# EAGLE design lp_proto (EAGLE 6.4)
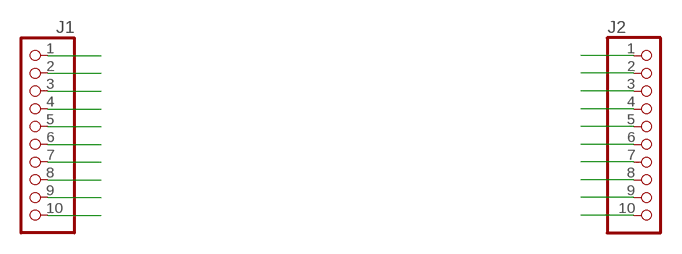
[diagram p0: schematic, sheet 1]

## Parts
J1  PH1X10OCT076  [PH1X10OCT76]
J2  PH1X10OCT076  [PH1X10OCT76]

## Nets
N$3: J2.5
N$21: J2.3
N$22: J2.6
N$23: J2.7
N$24: J2.8
N$25: J2.10
N$26: J2.9
N$99: J1.2
N$134: J1.10
N$136: J2.2
N$147: J1.3
N$262: J1.4
N$276: J1.5
N$346: J2.4
N$347: J1.9
N$348: J1.8
N$349: J1.7
N$350: J1.6
VCC: J1.1
VSS [Ground]: J2.1

## Library data of the parts
J1 J2 = MY_CONN:PH1X10

## Net classes
1 Ground: width 0.1 mm, drill 0.2 mm

## Board
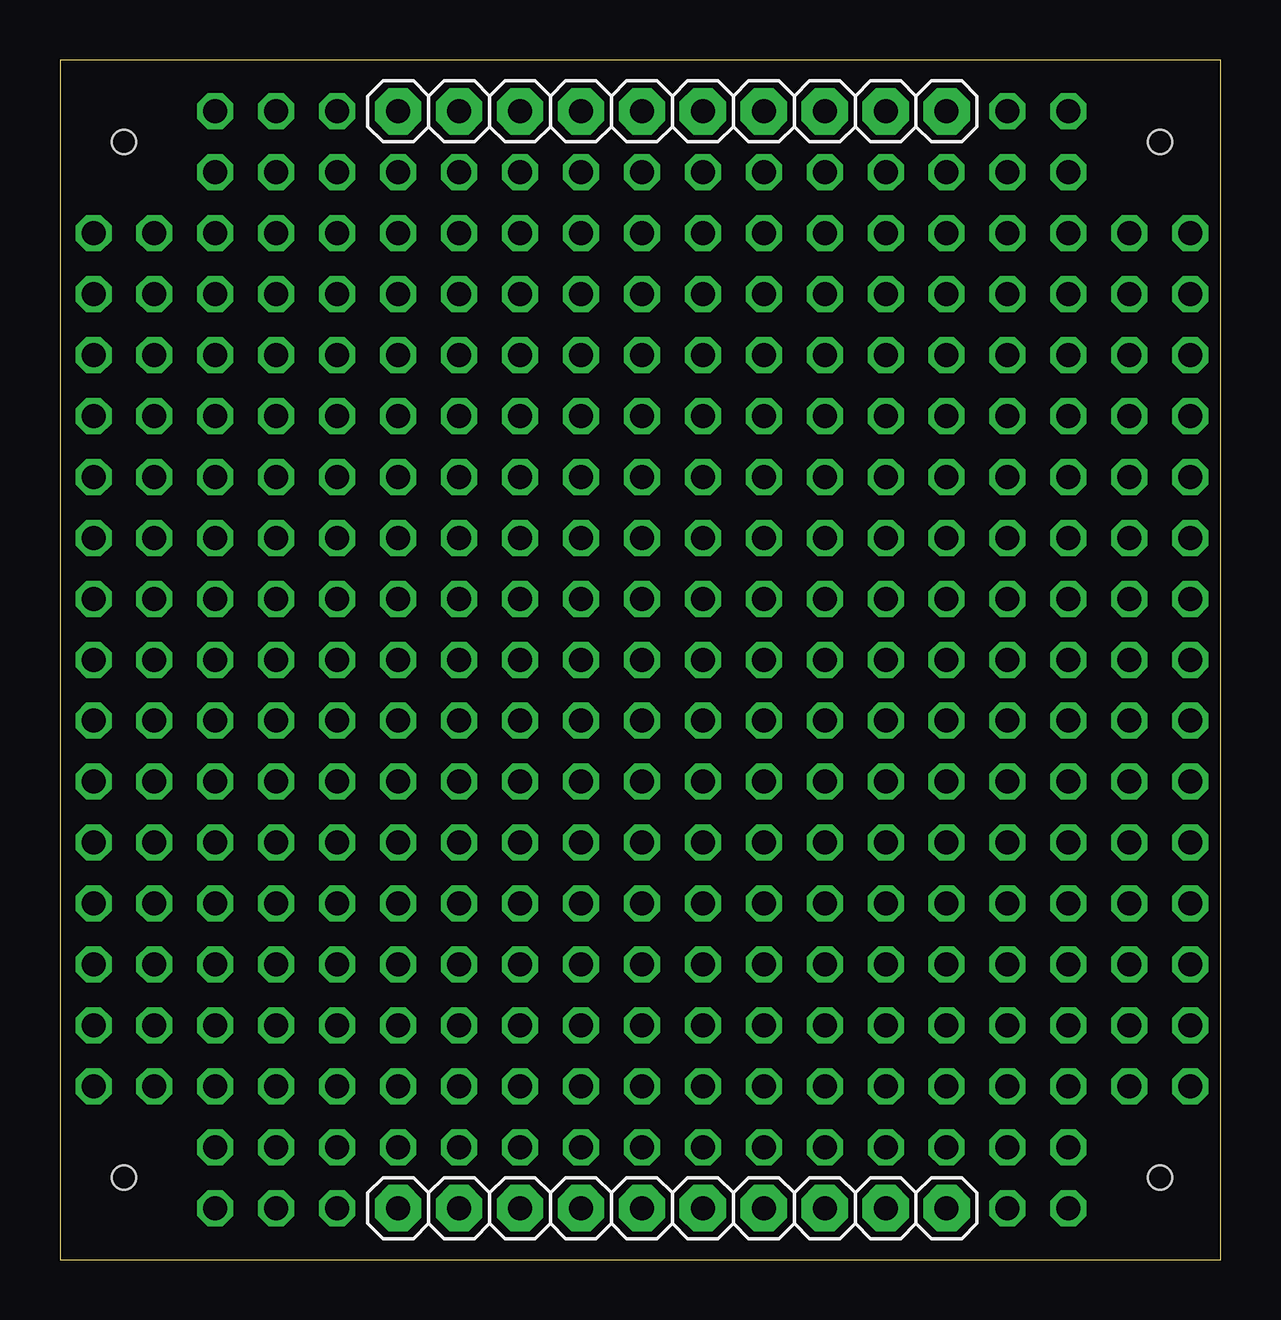
[diagram p1: board, top side]
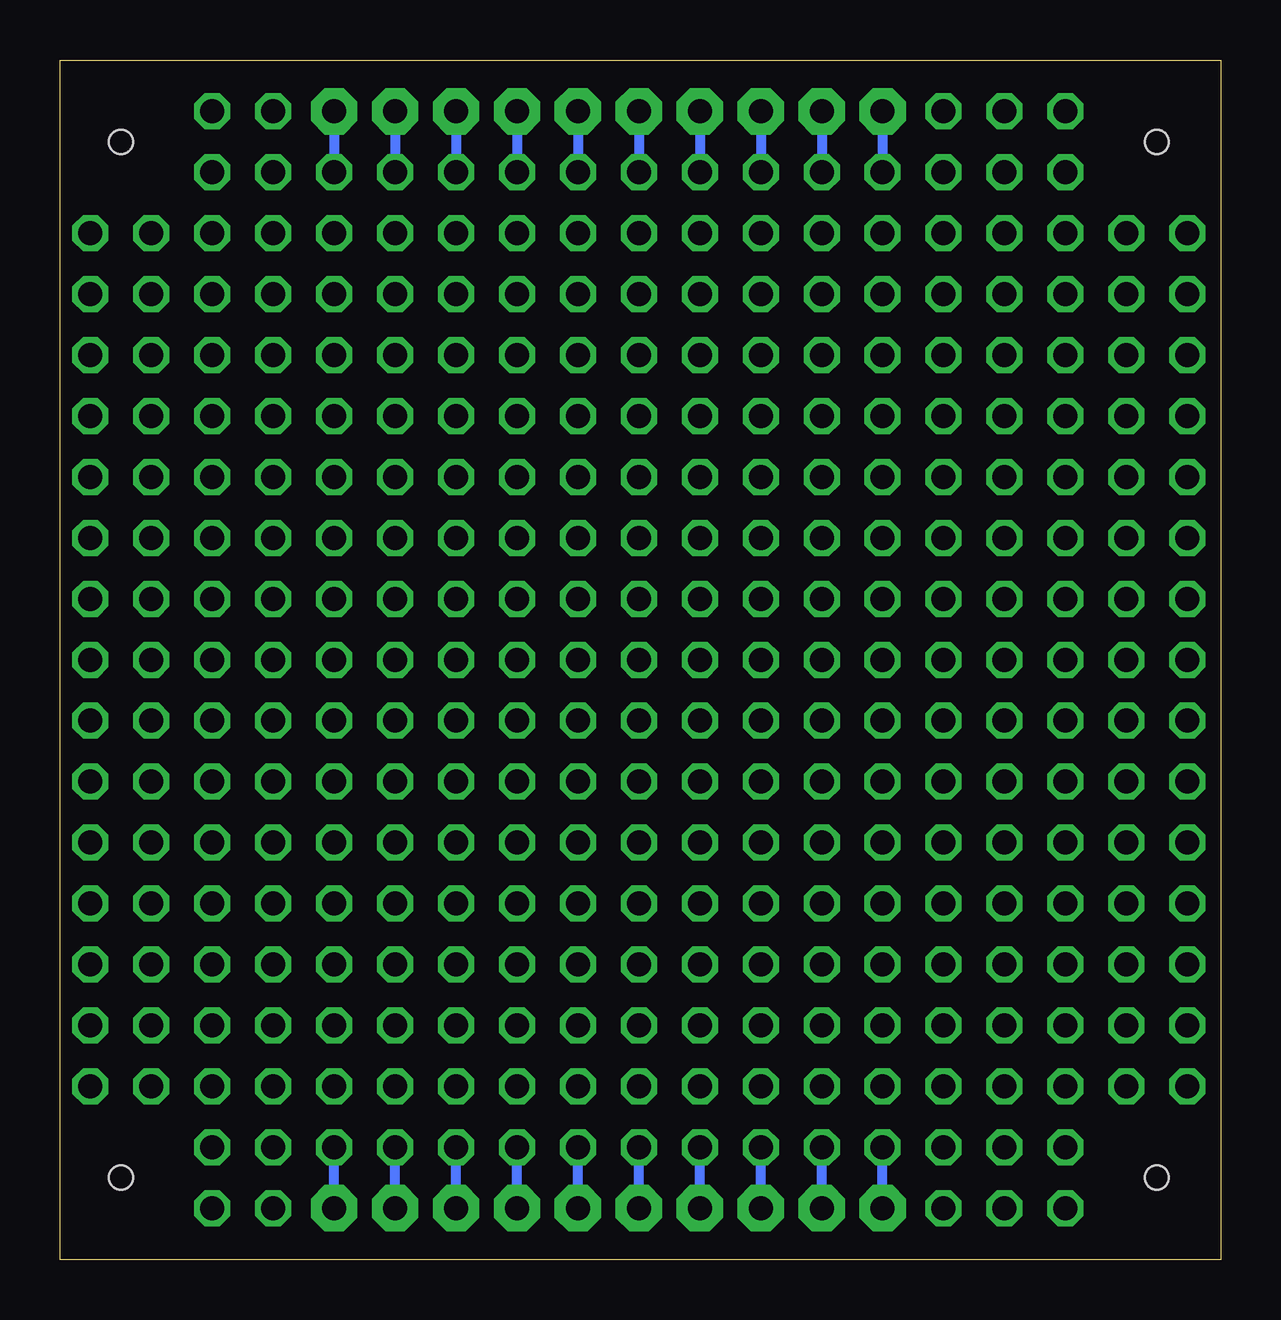
[diagram p2: board, bottom side, seen from below]

Size 48.39 x 50 mm. Coordinates in mm from the lower left corner, seen from the top.
Outline: 0,0 48.39,0 48.39,50 0,50 0,0
Copper layers (1*16): Top 0.035mm / dielectric 1.5mm / Bottom 0.035mm
Design rules "Fusion_eagle_rule_v1.1": minimum track width 6mil, minimum drill 12mil, track to track 6mil, track to pad 6mil, pad to pad 6mil, via to via 6mil, smd to smd 0mil, copper to edge 10mil, drill to drill 10mil, minimum pad ring 10mil, minimum via ring 6mil, stop-mask expansion 2mil, vias tented up to drill 100mil, thermal gap 10mil
Holes 1 mm at 45.85,46.59 45.85,3.41 2.67,3.41 2.67,46.59

### Footprints (pad centres in the part's own frame; a part is rotated, then mirrored left to right if it is on the bottom)
PH1X10OCT76 = drill 1 pad 1.93 octagon: 1 0,0; 2 2.54,0; 3 5.08,0; 4 7.62,0; 5 10.16,0; 6 12.7,0; 7 15.24,0; 8 17.78,0; 9 20.32,0; 10 22.86,0

### Placement (x,y rotation side)
J1  14.1,2.14 0 top
J2  14.1,47.86 0 top

### Tracks (layer width: path | path; a pad name or v marks a point on that pad's centre or on a via)
N$2  (via drill 1 pad 0.3)
  other vias: 9.02,47.86
N$3  (via drill 1)
  Bottom 0.406: J2.5 v24.26,45.32
N$5  (via drill 1)
  other vias: 6.48,2.14
N$6  (via drill 1)
  other vias: 9.02,2.14
N$7  (via drill 1)
  other vias: 11.56,2.14
N$8  (via drill 1)
  other vias: 39.5,2.14
N$9  (via drill 1)
  other vias: 42.04,2.14
N$11  (via drill 1)
  other vias: 47.12,40.24
N$15  (via drill 1)
  other vias: 6.48,4.68
N$16  (via drill 1 pad 0.3)
  other vias: 6.48,47.86
N$17  (via drill 1)
  other vias: 9.02,4.68
N$18  (via drill 1)
  other vias: 11.56,4.68
N$19  (via drill 1)
  other vias: 19.18,27.54
N$20  (via drill 1)
  other vias: 19.18,30.08
N$21  (via drill 1)
  Bottom 0.406: J2.3 v19.18,45.32
N$22  (via drill 1)
  Bottom 0.406: J2.6 v26.8,45.32
N$23  (via drill 1)
  Bottom 0.406: J2.7 v29.34,45.32
N$24  (via drill 1)
  Bottom 0.406: J2.8 v31.88,45.32
N$25  (via drill 1)
  Bottom 0.406: J2.10 v36.96,45.32
N$26  (via drill 1)
  Bottom 0.406: J2.9 v34.42,45.32
N$29  (via drill 1)
  other vias: 39.5,4.68
N$30  (via drill 1)
  other vias: 42.04,4.68
N$33  (via drill 1)
  other vias: 47.12,7.22
N$34  (via drill 1)
  other vias: 44.58,7.22
N$35  (via drill 1)
  other vias: 42.04,7.22
N$36  (via drill 1)
  other vias: 39.5,7.22
N$37  (via drill 1)
  other vias: 36.96,7.22
N$38  (via drill 1)
  other vias: 34.42,7.22
N$39  (via drill 1)
  other vias: 31.88,7.22
N$40  (via drill 1)
  other vias: 29.34,7.22
N$41  (via drill 1)
  other vias: 26.8,7.22
N$42  (via drill 1)
  other vias: 24.26,7.22
N$43  (via drill 1)
  other vias: 21.72,7.22
N$44  (via drill 1)
  other vias: 19.18,7.22
N$45  (via drill 1)
  other vias: 16.64,7.22
N$46  (via drill 1)
  other vias: 14.1,7.22
N$47  (via drill 1)
  other vias: 11.56,7.22
N$48  (via drill 1)
  other vias: 9.02,7.22
N$49  (via drill 1)
  other vias: 6.48,7.22
N$50  (via drill 1)
  other vias: 3.94,7.22
N$51  (via drill 1)
  other vias: 1.4,7.22
N$52  (via drill 1)
  other vias: 1.4,9.76
N$53  (via drill 1)
  other vias: 3.94,9.76
N$54  (via drill 1)
  other vias: 6.48,9.76
N$55  (via drill 1)
  other vias: 9.02,9.76
N$56  (via drill 1)
  other vias: 11.56,9.76
N$57  (via drill 1)
  other vias: 14.1,9.76
N$58  (via drill 1)
  other vias: 16.64,9.76
N$59  (via drill 1)
  other vias: 19.18,9.76
N$60  (via drill 1)
  other vias: 21.72,9.76
N$61  (via drill 1)
  other vias: 24.26,9.76
N$62  (via drill 1)
  other vias: 26.8,9.76
N$63  (via drill 1)
  other vias: 29.34,9.76
N$64  (via drill 1)
  other vias: 31.88,9.76
N$65  (via drill 1)
  other vias: 34.42,9.76
N$66  (via drill 1)
  other vias: 36.96,9.76
N$67  (via drill 1)
  other vias: 39.5,9.76
N$68  (via drill 1)
  other vias: 42.04,9.76
N$69  (via drill 1)
  other vias: 44.58,9.76
N$70  (via drill 1)
  other vias: 47.12,9.76
N$71  (via drill 1)
  other vias: 1.4,12.3
N$72  (via drill 1)
  other vias: 1.4,14.84
N$73  (via drill 1)
  other vias: 1.4,17.38
N$74  (via drill 1)
  other vias: 1.4,19.92
N$75  (via drill 1)
  other vias: 1.4,22.46
N$76  (via drill 1)
  other vias: 1.4,25
N$77  (via drill 1)
  other vias: 1.4,27.54
N$78  (via drill 1)
  other vias: 1.4,30.08
N$79  (via drill 1)
  other vias: 1.4,32.62
N$80  (via drill 1)
  other vias: 1.4,35.16
N$81  (via drill 1)
  other vias: 3.94,35.16
N$82  (via drill 1)
  other vias: 6.48,35.16
N$83  (via drill 1 pad 0.3)
  other vias: 1.4,37.7
N$84  (via drill 1)
  other vias: 47.12,37.7
N$85  (via drill 1)
  other vias: 47.12,32.62
N$86  (via drill 1 pad 0.3)
  other vias: 6.48,45.32
N$87  (via drill 1)
  other vias: 39.5,32.62
N$88  (via drill 1 pad 0.3)
  other vias: 11.56,47.86
N$90  (via drill 1 pad 0.3)
  other vias: 47.12,42.78
N$91  (via drill 1)
  other vias: 26.8,35.16
N$92  (via drill 1)
  other vias: 31.88,35.16
N$93  (via drill 1)
  other vias: 34.42,35.16
N$94  (via drill 1)
  other vias: 36.96,35.16
N$95  (via drill 1)
  other vias: 39.5,35.16
N$96  (via drill 1)
  other vias: 42.04,35.16
N$97  (via drill 1)
  other vias: 44.58,37.7
N$98  (via drill 1)
  other vias: 47.12,35.16
N$99  (via drill 1)
  Bottom 0.406: J1.2 v16.64,4.68
N$100  (via drill 1)
  other vias: 47.12,30.08
N$101  (via drill 1)
  other vias: 47.12,27.54
N$102  (via drill 1)
  other vias: 47.12,25
N$103  (via drill 1)
  other vias: 47.12,19.92
N$104  (via drill 1)
  other vias: 47.12,22.46
N$105  (via drill 1)
  other vias: 47.12,17.38
N$106  (via drill 1)
  other vias: 47.12,14.84
N$107  (via drill 1)
  other vias: 47.12,12.3
N$108  (via drill 1)
  other vias: 44.58,12.3
N$109  (via drill 1)
  other vias: 42.04,12.3
N$110  (via drill 1)
  other vias: 39.5,12.3
N$111  (via drill 1)
  other vias: 36.96,12.3
N$112  (via drill 1)
  other vias: 34.42,12.3
N$113  (via drill 1)
  other vias: 31.88,12.3
N$114  (via drill 1)
  other vias: 29.34,12.3
N$115  (via drill 1)
  other vias: 26.8,12.3
N$116  (via drill 1)
  other vias: 24.26,12.3
N$117  (via drill 1)
  other vias: 21.72,12.3
N$118  (via drill 1)
  other vias: 19.18,12.3
N$119  (via drill 1)
  other vias: 16.64,12.3
N$120  (via drill 1)
  other vias: 14.1,12.3
N$121  (via drill 1)
  other vias: 11.56,12.3
N$122  (via drill 1)
  other vias: 9.02,12.3
N$123  (via drill 1)
  other vias: 6.48,12.3
N$124  (via drill 1)
  other vias: 3.94,12.3
N$125  (via drill 1)
  other vias: 3.94,14.84
N$126  (via drill 1)
  other vias: 3.94,17.38
N$127  (via drill 1)
  other vias: 3.94,19.92
N$128  (via drill 1)
  other vias: 3.94,22.46
N$129  (via drill 1)
  other vias: 3.94,25
N$130  (via drill 1)
  other vias: 3.94,27.54
N$131  (via drill 1)
  other vias: 3.94,30.08
N$132  (via drill 1)
  other vias: 3.94,32.62
N$133  (via drill 1)
  other vias: 6.48,32.62
N$134  (via drill 1)
  Bottom 0.406: J1.10 v36.96,4.68
N$135  (via drill 1 pad 0.3)
  other vias: 39.5,47.86
N$136  (via drill 1)
  Bottom 0.406: J2.2 v16.64,45.32
N$137  (via drill 1)
  other vias: 29.34,35.16
N$138  (via drill 1)
  other vias: 42.04,45.32
N$139  (via drill 1)
  other vias: 9.02,42.78
N$140  (via drill 1)
  other vias: 9.02,40.24
N$141  (via drill 1)
  other vias: 11.56,42.78
N$142  (via drill 1)
  other vias: 29.34,32.62
N$143  (via drill 1)
  other vias: 31.88,32.62
N$144  (via drill 1)
  other vias: 34.42,32.62
N$145  (via drill 1)
  other vias: 36.96,32.62
N$146  (via drill 1)
  other vias: 42.04,32.62
N$147  (via drill 1)
  Bottom 0.406: J1.3 v19.18,4.68
N$148  (via drill 1)
  other vias: 44.58,32.62
N$149  (via drill 1)
  other vias: 44.58,30.08
N$150  (via drill 1)
  other vias: 44.58,27.54
N$151  (via drill 1)
  other vias: 44.58,25
N$152  (via drill 1)
  other vias: 44.58,22.46
N$153  (via drill 1)
  other vias: 44.58,19.92
N$154  (via drill 1)
  other vias: 44.58,17.38
N$155  (via drill 1)
  other vias: 44.58,14.84
N$156  (via drill 1)
  other vias: 42.04,14.84
N$157  (via drill 1)
  other vias: 39.5,14.84
N$158  (via drill 1)
  other vias: 36.96,14.84
N$159  (via drill 1)
  other vias: 34.42,14.84
N$160  (via drill 1)
  other vias: 31.88,14.84
N$161  (via drill 1)
  other vias: 29.34,14.84
N$162  (via drill 1)
  other vias: 26.8,14.84
N$163  (via drill 1)
  other vias: 24.26,14.84
N$164  (via drill 1)
  other vias: 21.72,14.84
N$165  (via drill 1)
  other vias: 19.18,14.84
N$166  (via drill 1)
  other vias: 16.64,14.84
N$167  (via drill 1)
  other vias: 14.1,14.84
N$168  (via drill 1)
  other vias: 11.56,14.84
N$169  (via drill 1)
  other vias: 9.02,14.84
N$170  (via drill 1)
  other vias: 6.48,14.84
N$171  (via drill 1)
  other vias: 6.48,17.38
N$172  (via drill 1)
  other vias: 6.48,19.92
N$173  (via drill 1)
  other vias: 6.48,22.46
N$174  (via drill 1)
  other vias: 6.48,25
N$175  (via drill 1)
  other vias: 6.48,27.54
N$176  (via drill 1)
  other vias: 6.48,30.08
N$177  (via drill 1)
  other vias: 9.02,37.7
N$178  (via drill 1)
  other vias: 11.56,32.62
N$179  (via drill 1)
  other vias: 14.1,22.46
N$180  (via drill 1)
  other vias: 24.26,30.08
N$181  (via drill 1)
  other vias: 29.34,25
N$182  (via drill 1)
  other vias: 26.8,27.54
N$183  (via drill 1)
  other vias: 26.8,25
N$184  (via drill 1)
  other vias: 36.96,37.7
N$185  (via drill 1)
  other vias: 29.34,30.08
N$186  (via drill 1)
  other vias: 31.88,30.08
N$187  (via drill 1)
  other vias: 34.42,30.08
N$188  (via drill 1)
  other vias: 36.96,30.08
N$189  (via drill 1)
  other vias: 39.5,30.08
N$190  (via drill 1)
  other vias: 42.04,30.08
N$191  (via drill 1)
  other vias: 42.04,25
N$192  (via drill 1)
  other vias: 42.04,27.54
N$193  (via drill 1)
  other vias: 42.04,22.46
N$194  (via drill 1)
  other vias: 42.04,19.92
N$195  (via drill 1)
  other vias: 42.04,17.38
N$196  (via drill 1)
  other vias: 39.5,17.38
N$197  (via drill 1)
  other vias: 36.96,17.38
N$198  (via drill 1)
  other vias: 34.42,17.38
N$199  (via drill 1)
  other vias: 31.88,17.38
N$200  (via drill 1)
  other vias: 29.34,17.38
N$201  (via drill 1)
  other vias: 26.8,17.38
N$202  (via drill 1)
  other vias: 24.26,17.38
N$203  (via drill 1)
  other vias: 21.72,17.38
N$204  (via drill 1)
  other vias: 19.18,17.38
N$205  (via drill 1)
  other vias: 16.64,17.38
N$206  (via drill 1)
  other vias: 14.1,17.38
N$207  (via drill 1)
  other vias: 11.56,17.38
N$208  (via drill 1)
  other vias: 9.02,17.38
N$209  (via drill 1)
  other vias: 9.02,19.92
N$210  (via drill 1)
  other vias: 9.02,22.46
N$211  (via drill 1)
  other vias: 39.5,37.7
N$212  (via drill 1)
  other vias: 42.04,37.7
N$213  (via drill 1)
  other vias: 44.58,35.16
N$214  (via drill 1)
  other vias: 9.02,45.32
N$215  (via drill 1 pad 0.3)
  other vias: 14.1,42.78
N$216  (via drill 1)
  other vias: 42.04,40.24
N$217  (via drill 1)
  other vias: 9.02,32.62
N$218  (via drill 1)
  other vias: 9.02,27.54
N$219  (via drill 1)
  other vias: 9.02,30.08
N$220  (via drill 1)
  other vias: 29.34,27.54
N$221  (via drill 1)
  other vias: 31.88,27.54
N$222  (via drill 1)
  other vias: 34.42,27.54
N$223  (via drill 1)
  other vias: 36.96,27.54
N$224  (via drill 1)
  other vias: 39.5,27.54
N$225  (via drill 1)
  other vias: 39.5,25
N$226  (via drill 1)
  other vias: 39.5,22.46
N$227  (via drill 1)
  other vias: 39.5,19.92
N$228  (via drill 1)
  other vias: 36.96,19.92
N$229  (via drill 1)
  other vias: 34.42,19.92
N$230  (via drill 1)
  other vias: 31.88,19.92
N$231  (via drill 1)
  other vias: 29.34,19.92
N$232  (via drill 1)
  other vias: 26.8,19.92
N$233  (via drill 1)
  other vias: 24.26,19.92
N$234  (via drill 1)
  other vias: 21.72,19.92
N$235  (via drill 1)
  other vias: 19.18,19.92
N$236  (via drill 1)
  other vias: 16.64,19.92
N$237  (via drill 1)
  other vias: 14.1,19.92
N$238  (via drill 1)
  other vias: 11.56,19.92
N$239  (via drill 1)
  other vias: 11.56,22.46
N$240  (via drill 1)
  other vias: 9.02,25
N$241  (via drill 1)
  other vias: 11.56,25
N$242  (via drill 1)
  other vias: 24.26,27.54
N$243  (via drill 1)
  other vias: 14.1,25
N$244  (via drill 1)
  other vias: 21.72,32.62
N$245  (via drill 1)
  other vias: 11.56,30.08
N$246  (via drill 1)
  other vias: 14.1,32.62
N$247  (via drill 1)
  other vias: 26.8,30.08
N$248  (via drill 1)
  other vias: 31.88,25
N$249  (via drill 1)
  other vias: 34.42,25
N$250  (via drill 1)
  other vias: 36.96,25
N$251  (via drill 1)
  other vias: 36.96,22.46
N$252  (via drill 1)
  other vias: 34.42,22.46
N$253  (via drill 1)
  other vias: 31.88,22.46
N$254  (via drill 1)
  other vias: 29.34,22.46
N$255  (via drill 1)
  other vias: 26.8,22.46
N$256  (via drill 1)
  other vias: 24.26,22.46
N$257  (via drill 1)
  other vias: 21.72,22.46
N$258  (via drill 1)
  other vias: 19.18,22.46
N$259  (via drill 1)
  other vias: 16.64,22.46
N$260  (via drill 1)
  other vias: 44.58,40.24
N$261  (via drill 1)
  other vias: 6.48,40.24
N$262  (via drill 1)
  Bottom 0.406: J1.4 v21.72,4.68
N$266  (via drill 1)
  other vias: 42.04,47.86
N$267  (via drill 1 pad 0.3)
  other vias: 3.94,37.7
N$268  (via drill 1 pad 0.3)
  other vias: 6.48,37.7
N$269  (via drill 1 pad 0.3)
  other vias: 3.94,40.24
N$270  (via drill 1 pad 0.3)
  other vias: 6.48,42.78
N$271  (via drill 1 pad 0.3)
  other vias: 3.94,42.78
N$272  (via drill 1)
  other vias: 24.26,35.16
N$273  (via drill 1)
  other vias: 11.56,37.7
N$274  (via drill 1)
  other vias: 39.5,40.24
N$275  (via drill 1)
  other vias: 11.56,45.32
N$276  (via drill 1)
  Bottom 0.406: J1.5 v24.26,4.68
N$277  (via drill 1 pad 0.3)
  other vias: 42.04,42.78
N$278  (via drill 1)
  other vias: 11.56,40.24
N$279  (via drill 1)
  other vias: 1.4,40.24
N$284  (via drill 1 pad 0.3)
  other vias: 1.4,42.78
N$285  (via drill 1)
  other vias: 14.1,37.7
N$286  (via drill 1)
  other vias: 9.02,35.16
N$287  (via drill 1)
  other vias: 21.72,37.7
N$288  (via drill 1)
  other vias: 16.64,30.08
N$289  (via drill 1)
  other vias: 14.1,27.54
N$290  (via drill 1)
  other vias: 16.64,25
N$291  (via drill 1)
  other vias: 11.56,35.16
N$292  (via drill 1)
  other vias: 16.64,37.7
N$293  (via drill 1)
  other vias: 31.88,37.7
N$294  (via drill 1 pad 0.3)
  other vias: 29.34,42.78
N$295  (via drill 1)
  other vias: 19.18,42.78
N$296  (via drill 1)
  other vias: 14.1,30.08
N$297  (via drill 1)
  other vias: 16.64,27.54
N$298  (via drill 1)
  other vias: 26.8,32.62
N$299  (via drill 1)
  other vias: 16.64,32.62
N$300  (via drill 1)
  other vias: 11.56,27.54
N$302  (via drill 1 pad 0.3)
  other vias: 44.58,42.78
N$303  (via drill 1 pad 0.3)
  other vias: 39.5,42.78
N$305  (via drill 1 pad 0.3)
  other vias: 16.64,42.78
N$308  (via drill 1 pad 0.3)
  other vias: 31.88,42.78
N$309  (via drill 1 pad 0.3)
  other vias: 21.72,42.78
N$310  (via drill 1)
  other vias: 19.18,40.24
N$311  (via drill 1)
  other vias: 14.1,40.24
N$312  (via drill 1)
  other vias: 36.96,40.24
N$313  (via drill 1 pad 0.3)
  other vias: 36.96,42.78
N$314  (via drill 1)
  other vias: 39.5,45.32
N$316  (via drill 1)
  other vias: 26.8,37.7
N$317  (via drill 1)
  other vias: 24.26,42.78
N$318  (via drill 1)
  other vias: 19.18,32.62
N$319  (via drill 1)
  other vias: 21.72,35.16
N$320  (via drill 1)
  other vias: 24.26,37.7
N$321  (via drill 1)
  other vias: 29.34,40.24
N$322  (via drill 1)
  other vias: 34.42,40.24
N$323  (via drill 1)
  other vias: 14.1,35.16
N$324  (via drill 1)
  other vias: 21.72,30.08
N$325  (via drill 1)
  other vias: 21.72,27.54
N$326  (via drill 1)
  other vias: 24.26,32.62
N$328  (via drill 1)
  other vias: 21.72,40.24
N$329  (via drill 1)
  other vias: 26.8,40.24
N$330  (via drill 1 pad 0.3)
  other vias: 26.8,42.78
N$332  (via drill 1 pad 0.3)
  other vias: 34.42,42.78
N$334  (via drill 1)
  other vias: 34.42,37.7
N$335  (via drill 1)
  other vias: 29.34,37.7
N$336  (via drill 1)
  other vias: 19.18,35.16
N$337  (via drill 1)
  other vias: 16.64,35.16
N$338  (via drill 1)
  other vias: 19.18,25
N$339  (via drill 1)
  other vias: 24.26,40.24
N$341  (via drill 1)
  other vias: 31.88,40.24
N$342  (via drill 1)
  other vias: 19.18,37.7
N$343  (via drill 1)
  other vias: 16.64,40.24
N$344  (via drill 1)
  other vias: 21.72,25
N$345  (via drill 1)
  other vias: 24.26,25
N$346  (via drill 1)
  Bottom 0.406: J2.4 v21.72,45.32
N$347  (via drill 1)
  Bottom 0.406: J1.9 v34.42,4.68
N$348  (via drill 1)
  Bottom 0.406: J1.8 v31.88,4.68
N$349  (via drill 1)
  Bottom 0.406: J1.7 v29.34,4.68
N$350  (via drill 1)
  Bottom 0.406: J1.6 v26.8,4.68
VCC  (via drill 1)
  Bottom 0.406: J1.1 v14.1,4.68
VSS  (via drill 1)
  Bottom 0.406: J2.1 v14.1,45.32